# EAGLE design ftdifriend (EAGLE 5.01)
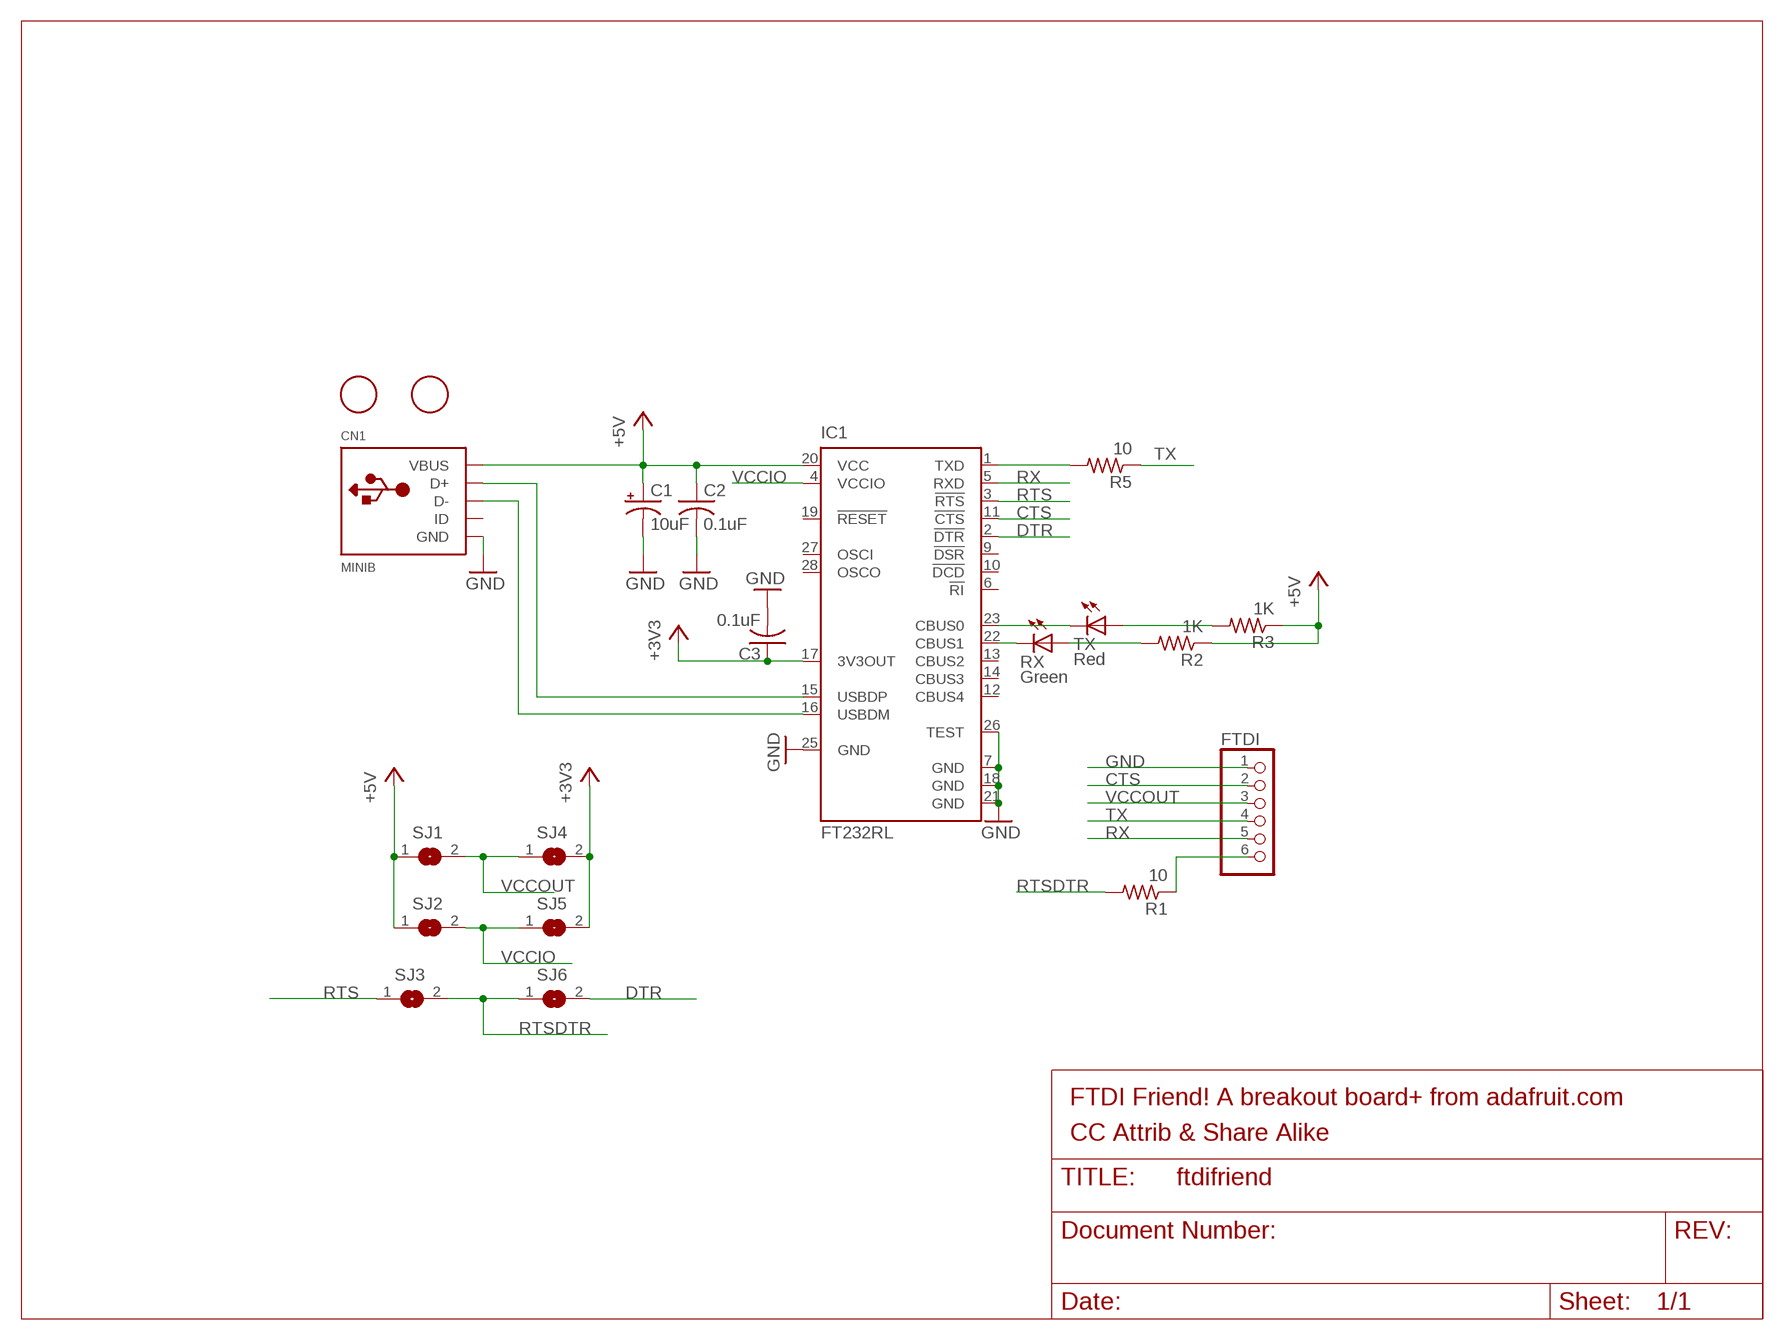
[diagram p0: schematic, sheet 1]

## Parts
C1  10uF  CPOL-USA/3216-18R  [A/3216-18R]
C2  0.1uF  C-USC0805K  [C0805K]
C3  0.1uF  C-USC0805K  [C0805K]
CN1  MINIB  USBMINIB  [USB-MINIB]
FTDI  PINHD-1X6CB  [1X06-CLEANBIG]
IC1  FT232RL  [SSOP28]
R1  10  R-US_R0805  [R0805]
R2  1K  R-US_R0805  [R0805]
R3  1K  R-US_R0805  [R0805]
R5  10  R-US_R0805  [R0805]
RX  Green  LEDCHIP-LED0805  [CHIP-LED0805]
SJ1  SJ  [SJ]
SJ2  SJ  [SJ]
SJ3  SJ  [SJ]
SJ4  SJ  [SJ]
SJ5  SJ  [SJ]
SJ6  SJ  [SJ]
TX  Red  LEDCHIP-LED0805  [CHIP-LED0805]
U$1  FIDUCIAL  [FIDUCIAL_1MM]
U$2  FIDUCIAL  [FIDUCIAL_1MM]

## Nets
+3V3: C3.1 IC1.17(3V3OUT) SJ4.2 SJ5.2
+5V: C1.+ C2.1 CN1.VBUS IC1.20(VCC) R2.1 R3.1 SJ1.1 SJ2.1
CTS: FTDI.2 IC1.11(!CTS)
DTR: IC1.2(!DTR) SJ6.2
GND: C1.- C2.2 C3.2 CN1.GND FTDI.1 IC1.7(GND) IC1.18(GND) IC1.21(GND) IC1.25(GND) IC1.26(TEST)
N$2: FTDI.6 R1.1
N$3: CN1.D+ IC1.15(USBDP)
N$4: CN1.D- IC1.16(USBDM)
N$5: IC1.1(TXD) R5.2
N$6: IC1.23(CBUS0) TX.C
N$7: IC1.22(CBUS1) RX.C
N$8: R2.2 RX.A
N$9: R3.2 TX.A
RTS: IC1.3(!RTS) SJ3.1
RTSDTR: R1.2 SJ3.2 SJ6.1
RX: FTDI.5 IC1.5(RXD)
TX: FTDI.4 R5.1
VCCIO: IC1.4(VCCIO) SJ2.2 SJ5.1
VCCOUT: FTDI.3 SJ1.2 SJ4.1
Unconnected: CN1.ID IC1.6(!RI) IC1.9(!DSR) IC1.10(!DCD) IC1.12(CBUS4) IC1.13(CBUS2) IC1.14(CBUS3) IC1.19(!RESET) IC1.27(OSCI) IC1.28(OSCO)

## Notes on the sheet
- FTDI Friend! A breakout board+ from adafruit.com
- CC Attrib & Share Alike

## Library data of the parts
C1 = adafruit:CPOL-US: POLARIZED CAPACITOR, American symbol
C2 C3 = adafruit:C-US: CAPACITOR, American symbol
CN1 = adafruit:USB: USB Connectors USBMINIB - Surface Mount Female Mini-B USB Connector 4UConnector: 06564 By microbuilder.eu Thru-hole RA Female Mini-B USB Connector 4UConnector: 18732 By ladyada.net
FTDI = adafruit:PINHD-1X6: PIN HEADER
IC1 = ftdichip:FT232R: Source: http://www.ftdichip.com/Documents/DataSheets/DS_FT232R_v104.pdf
R1-R3 R5 = adafruit:R-US_: RESISTOR, American symbol
RX TX = adafruit:LED: LED OSRAM: - CHIPLED LG R971, LG N971, LY N971, LG Q971, LY Q971, LO R971, LY R971 LH N974, LH R974 LS Q976, LO Q976, LY Q976 LO Q996 - Hyper CHIPLED LW Q18S LB Q993, LB Q99A, LB R99A - SideLED LS A670, LO A670, LY A670, LG A670, LP A670 LB A673, LV A673, LT A673, LW A673 LH A674 LY A675 LS A676, LA A676, LO A676, LY A676, LW A676 LS A679, LY A679, LG A679 - Hyper Micro SIDELED® LS Y876, LA Y876, LO Y876, LY Y876 LT Y87S - SmartLED LW L88C, LW L88S LB L89C, LB L89S, LG L890 LS L89K, LO L89K, LY L89K LS L896, LA L896, LO L896, LY L896 - TOPLED LS T670, LO T670, LY T670, LG T670, LP T670 LSG T670, LSP T670, LSY T670, LOP T670, LYG T670 LG T671, LOG T671, LSG T671 LB T673, LV T673, LT T673, LW T673 LH T674 LS T676, LA T676, LO T676, LY T676, LB T676, LH T676, LSB T676, LW T676 LB T67C, LV T67C, LT T67C, LS T67K, LO T67K, LY T67K, LW E67C LS E67B, LA E67B, LO E67B, LY E67B, LB E67C, LV E67C, LT E67C LW T67C LS T679, LY T679, LG T679 LS T770, LO T770, LY T770, LG T770, LP T770 LB T773, LV T773, LT T773, LW T773 LH T774 LS E675, LA E675, LY E675, LS T675 LS T776, LA T776, LO T776, LY T776, LB T776 LHGB T686 LT T68C, LB T68C - Hyper Mini TOPLED® LB M676 - Mini TOPLED Santana® LG M470 LS M47K, LO M47K, LY M47K Source: http://www.osram.convergy.de/
SJ1-SJ6 = jumper:SJ: SMD solder JUMPER
U$1 U$2 = adafruit:FIDUCIAL: For use by pick and place machines to calibrate the vision/machine, 1mm By microbuilder.eu

## Board
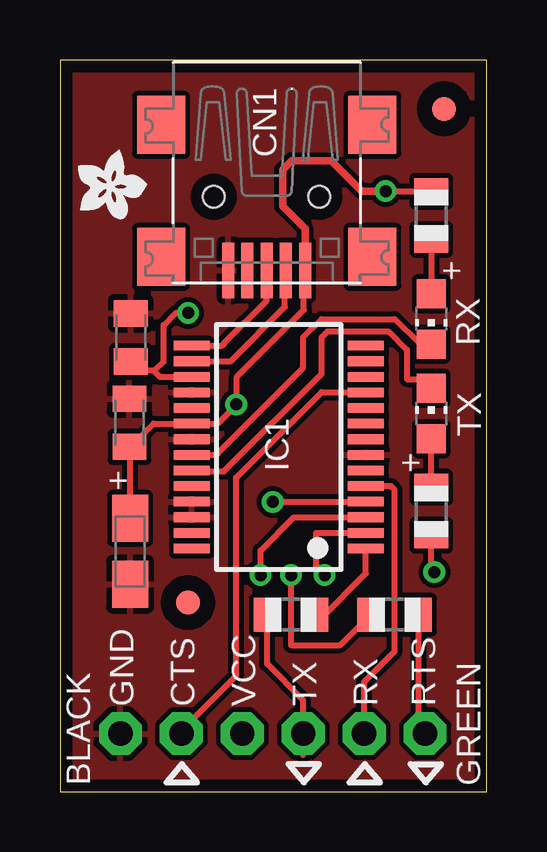
[diagram p1: board, top side]
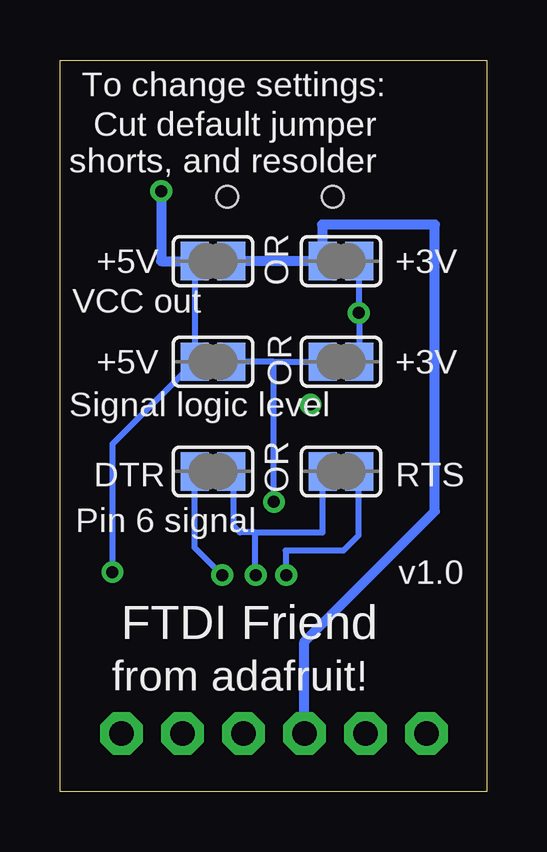
[diagram p2: board, bottom side, seen from below]

Size 17.78 x 30.48 mm. Coordinates in mm from the lower left corner, seen from the top.
Outline: 0,30.48 0,0 17.78,0 17.78,30.48 0,30.48
Copper layers (1*16): Top 0.035mm / dielectric 1.5mm / Bottom 0.035mm
Design rules "default *": minimum track width 10mil, minimum drill 19mil, track to track 8mil, track to pad 8mil, pad to pad 8mil, via to via 8mil, smd to smd 8mil, copper to edge 20mil, drill to drill 8mil, minimum pad ring 10mil, minimum via ring 8mil, stop-mask expansion 4mil, vias tented up to drill 20mil, thermal gap 10mil

### Footprints (pad centres in the part's own frame; a part is rotated, then mirrored left to right if it is on the bottom)
A/3216-18R = smd 1.95 x 1.5: + 1.375,0; - -1.375,0
C0805K = smd 1.1 x 1.4: 1 -1,0; 2 1,0
USB-MINIB = smd 0.5 x 2.308: D+ 0,4.064; D- -0.8,4.064; GND 1.6,4.064; ID 0.8,4.064; VBUS -1.6,4.064 | smd 2 x 2.4: GND1 -4.4,-2; GND2 -4.4,3.5; GND3 4.4,3.5; GND4 4.4,-2 | hole 0.9: -2.2,1; 2.2,1
1X06-CLEANBIG = drill 1.016 pad 1.778 octagon: 1 -6.35,0; 2 -3.81,0; 3 -1.27,0; 4 1.27,0; 5 3.81,0; 6 6.35,0
SSOP28 = smd 0.4 x 1.5: 1 -4.225,-3.625; 2 -3.575,-3.625; 3 -2.925,-3.625; 4 -2.275,-3.625; 5 -1.625,-3.625; 6 -0.975,-3.625; 7 -0.325,-3.625; 8 0.325,-3.625; 9 0.975,-3.625; 10 1.625,-3.625; 11 2.275,-3.625; 12 2.925,-3.625; 13 3.575,-3.625; 14 4.225,-3.625; 15 4.225,3.625; 16 3.575,3.625; 17 2.925,3.625; 18 2.275,3.625; 19 1.625,3.625; 20 0.975,3.625; 21 0.325,3.625; 22 -0.325,3.625; 23 -0.975,3.625; 24 -1.625,3.625; 25 -2.275,3.625; 26 -2.925,3.625; 27 -3.575,3.625; 28 -4.225,3.625
R0805 = smd 1.1 x 1.4: 1 -1,0; 2 1,0
CHIP-LED0805 = smd 1.2 x 1.2: A 0,-1.05; C 0,1.05
SJ = smd 1.168 x 1.6: 1 -0.762,0; 2 0.762,0
FIDUCIAL_1MM = smd 1 x 1: 1 0,0

### Placement (x,y rotation side)
C1  2.92,10.01 90 top
C2  2.9,15.37 90 top
C3  2.95,18.92 90 top
CN1  8.61,25.78 180 top
FTDI  8.86,2.41 0 top
IC1  9.12,14.35 90 top
R1  13.94,7.37 180 top
R2  15.47,24 270 top
R3  15.47,11.68 90 top
R5  9.63,7.37 0 top
RX  15.47,19.68 180 top
SJ1  11.4,22.1 0 bottom
SJ2  11.4,17.91 0 bottom
SJ3  6.07,13.34 180 bottom
SJ4  6.07,22.1 0 bottom
SJ5  6.07,17.91 0 bottom
SJ6  11.4,13.34 180 bottom
TX  15.47,15.75 0 top
U$1  16,28.45 270 top
U$2  5.33,7.87 270 top
U$3  [ADAFRUIT200MIL]  2.16,25.4 270 top

### Tracks (layer width: path | path; a pad name or v marks a point on that pad's centre or on a via)
+3V3  (via drill 0.5)
  Top 0.254: IC1.17 4.16,17.28 3.91,17.53 | 3.17,17.78 3.19,17.8 | 3.91,17.53 3.43,17.53 3.17,17.78 | 2.95,18.01 2.92,18.03 | 2.95,18.01 C3.1 | 3.17,17.78 2.95,18.01 | v5.33,19.94 4.83,19.94 4.32,19.43 4.32,17.91 3.94,17.53 3.91,17.53
  Bottom 0.254: 5.31,19.91 SJ4.2 | 5.31,19.91 SJ5.2 | v5.33,19.94 5.31,19.91
+5V  (via drill 0.5)
  Top 0.254: CN1.VBUS 10.16,21.67 10.16,20.07 7.37,17.27 7.37,16.13 v7.34,16.13 7.34,16.1 6.56,15.33 IC1.20 3.9,15.33 2.94,14.37 C2.1 2.9,14.45 2.92,14.48 C1.+ | v13.56,25.02 13.59,25.02 13.61,25 R2.1 | v15.6,9.14 15.62,9.14 15.47,9.3 R3.1
  Top 0.305: CN1.VBUS 10.21,23.44 9.27,24.38 9.27,25.91 9.65,26.29 11.3,26.29 12.57,25.02 13.46,25.02 13.56,24.92 | 13.56,24.92 13.59,24.89 | 13.56,24.92 v13.56,25.02
  Bottom 0.254: v15.6,9.14 15.6,14.48 SJ2.1 12.17,22.07 12.19,22.1 SJ1.1 | 7.34,16.38 v7.34,16.13 7.34,16 7.37,16
  Bottom 0.406: v13.56,25.02 13.56,22.1 12.19,22.1
CTS
  Top 0.254: FTDI.2 5.05,2.54 7.34,4.83 7.34,13.08 10.9,16.64 12.17,16.64 12.18,16.63 IC1.11
DTR  (via drill 0.5)
  Top 0.254: IC1.2 10.67,10.78 10.67,9.4 11.05,9.02 v11.02,9.02
  Bottom 0.254: v11.02,9.02 12.17,10.16 SJ6.2
GND
  pour Top: 18.26,30.61 -0.28,30.61 -0.53,-0.13 18.01,0
N$1
  Bottom 0.254: 6.6,13.34 5.46,13.34
N$2
  Top 0.254: R1.1 14.95,2.68 FTDI.6
N$3
  Top 0.254: CN1.D+ 8.61,20.45 6.83,18.67 6.86,18.67 6.76,18.58 IC1.15
N$4
  Top 0.254: IC1.16 7.11,17.93 9.37,20.19 9.37,21.21 9.41,21.25 CN1.D-
N$5
  Top 0.254: IC1.1 12.74,9.09 10.88,7.22 10.68,7.22 10.54,7.37 R5.2
N$6
  Top 0.254: IC1.23 5.01,13.38 5.05,13.34 6.83,13.34 10.9,17.4 10.9,18.92 11.15,19.18 13.69,19.18 14.45,18.41 14.45,17.18 15.08,17.18 15.62,16.64 | 15.62,16.64 15.62,16.57 | 15.62,16.64 15.62,16.77 | 15.62,16.64 TX.C
N$7
  Top 0.254: IC1.22 6.53,14.03 6.6,14.1 6.58,14.1 10.13,17.65 10.13,18.92 10.9,19.68 13.95,19.68 14.96,18.67 15.49,18.67 15.49,18.66 RX.C
N$8
  Top 0.254: RX.A 15.49,20.76 15.49,22.99 15.47,23.01 | 15.47,23.01 15.37,23.11 | 15.47,23.01 R2.2
N$9
  Top 0.254: R3.2 TX.A
N$12
  Bottom 0.254: 6.73,17.91 5.21,17.91
N$13
  Bottom 0.254: 12.06,22.1 10.54,22.1 10.41,22.35
RTS  (via drill 0.5)
  Top 0.254: IC1.3 9.75,11.43 8.36,10.03 v8.36,9.02
  Bottom 0.254: 5.56,13.59 SJ3.1 5.33,13.34 | v8.36,9.02 8.38,9.02 8.38,10.03 5.97,10.03 5.33,10.67 5.33,13.34 | 5.59,13.21 5.46,13.21 5.33,13.34
RTSDTR  (via drill 0.5)
  Top 0.254: R1.2 11.68,6.1 9.63,6.1 v9.63,9.02
  Bottom 0.254: 10.54,13.44 10.54,13.46 | 10.54,13.44 SJ6.1 | v9.63,9.02 9.65,9.04 9.65,10.79 | 9.65,10.79 10.29,10.79 10.54,11.05 10.54,13.44 | SJ3.2 6.83,10.79 9.65,10.79
RX
  Top 0.254: FTDI.5 12.68,4.57 13.95,5.84 13.95,12.57 13.79,12.73 IC1.5
TX
  Top 0.254: R5.1 8.63,5.32 10.13,3.81 FTDI.4 10.13,1.52
VCCIO  (via drill 0.5)
  Top 0.254: IC1.4 8.88,12.08 v8.87,12.06
  Bottom 0.254: 8.87,17.91 SJ5.1 | 8.87,17.91 SJ2.2 | v8.87,12.06 8.87,17.91
VCCOUT
  Bottom 0.254: 7.34,22.1 7.09,22.35 SJ4.1 6.83,21.97 6.86,21.97
  Bottom 0.406: 7.34,22.1 SJ1.2 | FTDI.3 7.59,6.25 2.16,11.68 2.16,23.62 6.86,23.62 6.86,21.97

### Text on the board
tPlace: GND | CTS | VCC | TX | RX | RTS | BLACK | GREEN
bPlace: To change settings: | Cut default jumper | shorts, and resolder | OR | +3V | +5V | VCC out | OR | +3V | +5V | Signal logic level | OR | RTS | DTR | Pin 6 signal | v1.0 | FTDI Friend | from adafruit!